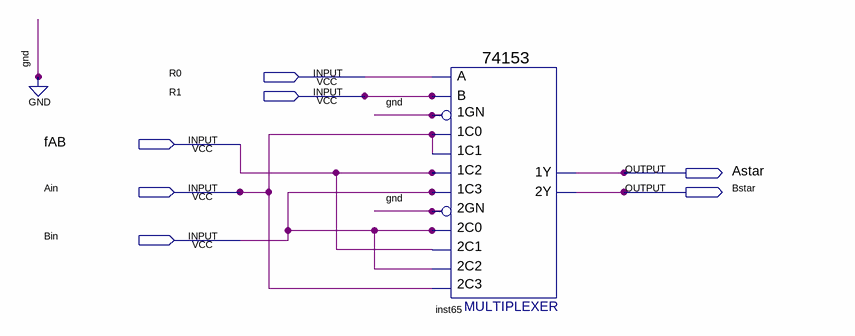
[diagram p0: schematic sheet]
// Quartus schematic routing_unit.bdf as structural Verilog: 1 symbols, 7 pins
module routing_unit (
  input  R0,
  input  R1,
  input  fAB,
  input  Ain,
  input  Bin,
  output Astar,
  output Bstar
);

  \74153  inst65 (
    .\1C1 (Ain), .\1GN (1'b0), .\1C0 (Ain), .\2C0 (Bin), .\2GN (1'b0), .\2C2 (Bin), .\1C2 (fAB), .\1C3 (Bin),
    .B(R1), .A(R0), .\2C1 (fAB), .\2C3 (Ain), .\1Y (Astar), .\2Y (Bstar));
endmodule
